# EAGLE design main_V2 (EAGLE 8.5.1)

## Sheet 1 of 7: ESP-12E Main
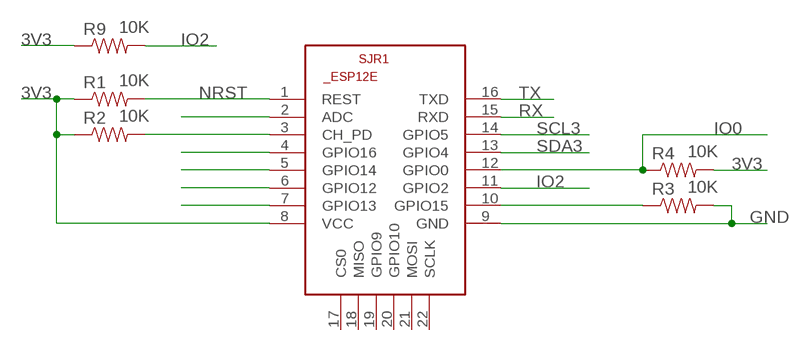
[diagram p0: schematic, sheet 1]

### Parts
R1  10K  RESISTOR1206  [1206]
R2  10K  RESISTOR1206  [1206]
R3  10K  RESISTOR1206  [1206]
R4  10K  RESISTOR1206  [1206]
R9  10K  RESISTOR1206  [1206]
SJR1  ESP8266-12EESP12E  [ESP8266-ESP12E]

### Nets
3V3: R1.1 R2.1 R4.2 R9.1 SJR1.8(VCC) ; also sheet 4,5
GND: R3.2 SJR1.9(GND) ; also sheet 2,3,4,6,7
IO0: R4.1 SJR1.12(GPIO0) ; also sheet 2
IO2: R9.2 SJR1.11(GPIO2)
N$2: R2.2 SJR1.3(CH_PD)
N$4: R3.1 SJR1.10(GPIO15)
N$8: SJR1.2(ADC)
N$9: SJR1.4(GPIO16)
N$10: SJR1.5(GPIO14)
N$11: SJR1.6(GPIO12)
N$12: SJR1.7(GPIO13)
NRST: R1.2 SJR1.1(REST) ; also sheet 2
RX: SJR1.15(RXD) ; also sheet 2
SCL3: SJR1.14(GPIO5) ; also sheet 5
SDA3: SJR1.13(GPIO4) ; also sheet 5
TX: SJR1.16(TXD) ; also sheet 2
Unconnected: SJR1.17(CS0) SJR1.18(MISO) SJR1.19(GPIO9) SJR1.20(GPIO10) SJR1.21(MOSI) SJR1.22(SCLK)

## Sheet 2 of 7: USB Interface
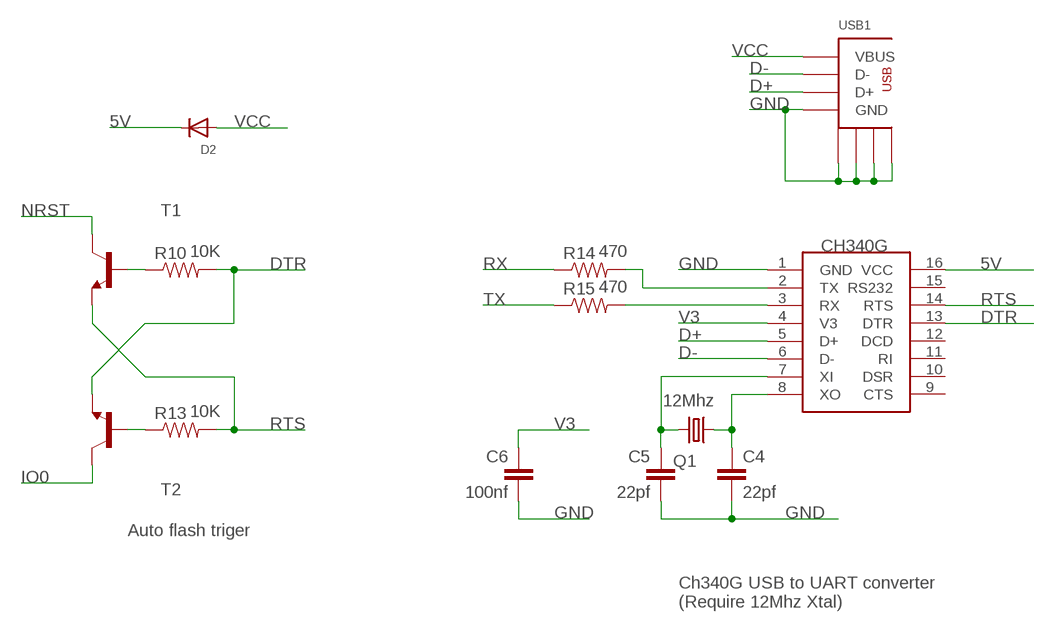
[diagram p1: schematic, sheet 2]

### Parts
C4  22pf  C-EUC1206K  [C1206K]
C5  22pf  C-EUC1206K  [C1206K]
C6  100nf  C-EUC1206K  [C1206K]
D2  DIODESMA  [SMADIODE]
Q1  12Mhz  CSM-7X-DU  [CSM-7X-DU]
R10  10K  RESISTOR1206  [1206]
R13  10K  RESISTOR1206  [1206]
R14  470  RESISTOR1206  [1206]
R15  470  RESISTOR1206  [1206]
T1  MMBT5551LT1-NPN-SOT23-BEC  [SOT23-BEC]
T2  MMBT5551LT1-NPN-SOT23-BEC  [SOT23-BEC]
U$1  CH340G  [SOIC16]
USB1  USB3MINI  [USB-MB-S]

### Nets
5V: D2.C U$1.16(VCC) ; also sheet 4,5,6
D+: U$1.5(D+) USB1.D+
D-: U$1.6(D-) USB1.D-
DTR: R10.2 T2.E U$1.13(DTR)
GND: C4.2 C5.2 C6.2 U$1.1(GND) USB1.GND USB1.P$1(GND) USB1.P$2(GND) USB1.P$3(GND) USB1.P$4(GND) ; also sheet 1,3,4,6,7
IO0: T2.C ; also sheet 1
N$13: C4.1 Q1.1 U$1.8(XO)
N$14: C5.1 Q1.2 U$1.7(XI)
N$15: R10.1 T1.B
N$18: R13.1 T2.B
N$19: R15.2 U$1.3(RX)
N$20: R14.2 U$1.2(TX)
NRST: T1.C ; also sheet 1
RTS: R13.2 T1.E U$1.14(RTS)
RX: R14.1 ; also sheet 1
TX: R15.1 ; also sheet 1
V3: C6.1 U$1.4(V3)
VCC: D2.A USB1.VBUS
Unconnected: U$1.9(CTS) U$1.10(DSR) U$1.11(RI) U$1.12(DCD) U$1.15(RS232)

### Notes on the sheet
- Auto flash triger
- Ch340G USB to UART converter 
  (Require 12Mhz Xtal)

## Sheet 3 of 7: Lio-Ion Charging
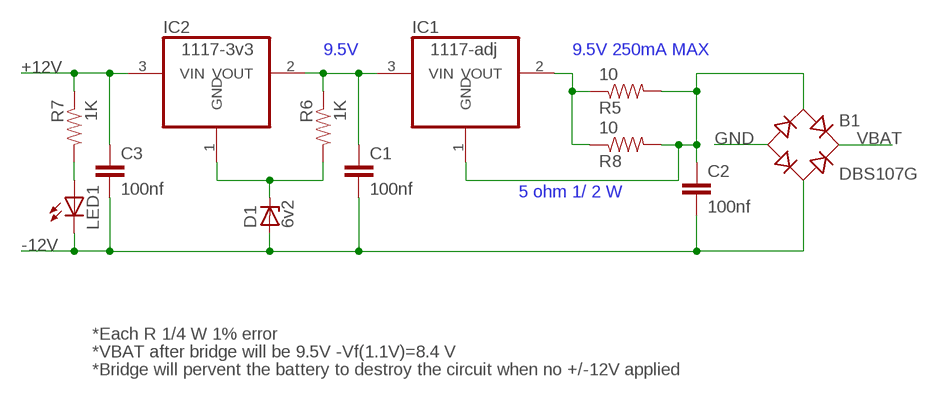
[diagram p2: schematic, sheet 3]

### Parts
B1  DBS107G  [DBS]
C1  100nf  C-EUC1206K  [C1206K]
C2  100nf  C-EUC1206K  [C1206K]
C3  100nf  C-EUC1206K  [C1206K]
D1  6v2  ZENER-DIODESOT23  [SOT23]
IC1  1117-adj  REG1117  [SOT223]
IC2  1117-3v3  REG1117  [SOT223]
LED1  LEDSMT1206  [1206]
R5  10  RESISTOR1206  [1206]
R6  1K  RESISTOR1206  [1206]
R7  1K  RESISTOR1206  [1206]
R8  10  RESISTOR1206  [1206]

### Nets
+12V: C3.1 IC2.3(VIN) R7.1
-12V: B1.AC2 C1.2 C2.2 C3.2 D1.1(A) LED1.C
GND: B1.- ; also sheet 1,2,4,6,7
N$3: D1.3(C) IC2.1(GND) R6.2
N$5: B1.AC1 C2.1 IC1.1(GND) R5.2 R8.2
N$6: IC1.2(VOUT) R5.1 R8.1
N$7: C1.1 IC1.3(VIN) IC2.2(VOUT) R6.1
N$17: LED1.A R7.2
VBAT: B1.+ ; also sheet 4

### Notes on the sheet
- 9.5V | 9.5V 250mA MAX
- 5 ohm 1/ 2 W
- *Each R 1/4 W 1% error
- *VBAT after bridge will be 9.5V -Vf(1.1V)=8.4 V
- *Bridge will pervent the battery to destroy the circuit when no +/-12V applied

## Sheet 4 of 7: power manegment
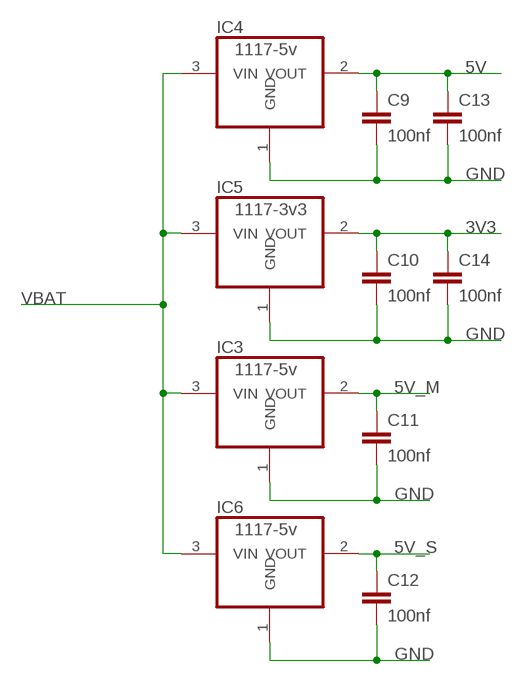
[diagram p3: schematic, sheet 4]

### Parts
C9  100nf  C-EUC1206K  [C1206K]
C10  100nf  C-EUC1206K  [C1206K]
C11  100nf  C-EUC1206K  [C1206K]
C12  100nf  C-EUC1206K  [C1206K]
C13  100nf  C-EUC1206K  [C1206K]
C14  100nf  C-EUC1206K  [C1206K]
IC3  1117-5v  REG1117  [SOT223]
IC4  1117-5v  REG1117  [SOT223]
IC5  1117-3v3  REG1117  [SOT223]
IC6  1117-5v  REG1117  [SOT223]

### Nets
3V3: C10.1 C14.1 IC5.2(VOUT) ; also sheet 1,5
5V: C9.1 C13.1 IC4.2(VOUT) ; also sheet 2,5,6
5V_M: C11.1 IC3.2(VOUT) ; also sheet 7
5V_S: C12.1 IC6.2(VOUT)
GND: C9.2 C10.2 C11.2 C12.2 C13.2 C14.2 IC3.1(GND) IC4.1(GND) IC5.1(GND) IC6.1(GND) ; also sheet 1,2,3,6,7
VBAT: IC3.3(VIN) IC4.3(VIN) IC5.3(VIN) IC6.3(VIN) ; also sheet 3

## Sheet 5 of 7: I2C Logic Level Converter
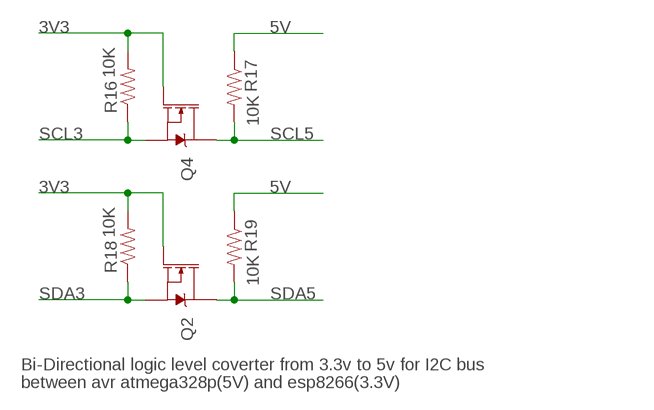
[diagram p4: schematic, sheet 5]

### Parts
Q2  MOSFET-NCH-BSS138  [SOT23-3]
Q4  MOSFET-NCH-BSS138  [SOT23-3]
R16  10K  RESISTOR1206  [1206]
R17  10K  RESISTOR1206  [1206]
R18  10K  RESISTOR1206  [1206]
R19  10K  RESISTOR1206  [1206]

### Nets
3V3: Q2.1(G) Q4.1(G) R16.2 R18.2 ; also sheet 1,4
5V: R17.1 R19.1 ; also sheet 2,4,6
SCL3: Q4.2(S) R16.1 ; also sheet 1
SCL5: Q4.3(D) R17.2 ; also sheet 6
SDA3: Q2.2(S) R18.1 ; also sheet 1
SDA5: Q2.3(D) R19.2 ; also sheet 6

### Notes on the sheet
- Bi-Directional logic level coverter from 3.3v to 5v for I2C bus
- between avr atmega328p(5V) and esp8266(3.3V)

## Sheet 6 of 7: Atmeg328p TQFP
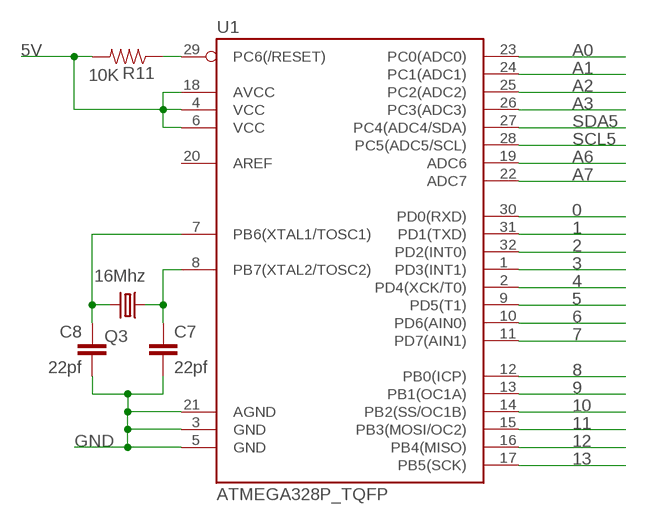
[diagram p5: schematic, sheet 6]

### Parts
C7  22pf  C-EUC1206K  [C1206K]
C8  22pf  C-EUC1206K  [C1206K]
Q3  16Mhz  CSM-7X-DU  [CSM-7X-DU]
R11  10K  RESISTOR1206  [1206]
U1  ATMEGA328P_TQFP  [TQFP32-08]

### Nets
0: U1.30(PD0(RXD))
1: U1.31(PD1(TXD))
2: U1.32(PD2(INT0))
3: U1.1(PD3(INT1))
4: U1.2(PD4(XCK/T0))
5: U1.9(PD5(T1))
5V: R11.2 U1.4(VCC) U1.6(VCC) U1.18(AVCC) ; also sheet 2,4,5
6: U1.10(PD6(AIN0))
7: U1.11(PD7(AIN1))
8: U1.12(PB0(ICP))
9: U1.13(PB1(OC1A))
10: U1.14(PB2(SS/OC1B))
11: U1.15(PB3(MOSI/OC2))
12: U1.16(PB4(MISO))
13: U1.17(PB5(SCK))
A0: U1.23(PC0(ADC0))
A1: U1.24(PC1(ADC1))
A2: U1.25(PC2(ADC2))
A3: U1.26(PC3(ADC3))
A6: U1.19(ADC6)
A7: U1.22(ADC7)
GND: C7.2 C8.2 U1.3(GND) U1.5(GND) U1.21(AGND) ; also sheet 1,2,3,4,7
N$1: C7.1 Q3.1 U1.8(PB7(XTAL2/TOSC2))
N$16: C8.1 Q3.2 U1.7(PB6(XTAL1/TOSC1))
N$21: R11.1 U1.29(PC6(/RESET))
SCL5: U1.28(PC5(ADC5/SCL)) ; also sheet 5
SDA5: U1.27(PC4(ADC4/SDA)) ; also sheet 5
Unconnected: U1.20(AREF)

## Sheet 7 of 7: DC H-Bridge
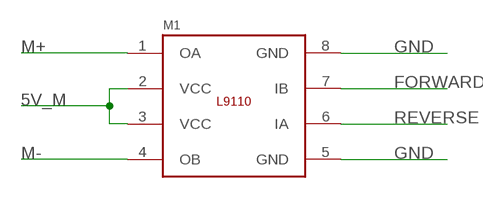
[diagram p6: schematic, sheet 7]

### Parts
M1  L9110  [SO8P]

### Nets
5V_M: M1.2(VCC) M1.3(VCC) ; also sheet 4
FORWARD: M1.7(IB)
GND: M1.5(GND) M1.8(GND) ; also sheet 1,2,3,4,6
M+: M1.1(OA)
M-: M1.4(OB)
REVERSE: M1.6(IA)

## Library data of the parts
B1 = rectifier:DB?*G: Single Phase 1.0 AMP Glass Passivated Bridge Rectifier Taiwan Semiconductor Co.,Ltd. - TSC Source: http://www.taiwansemi.com/TSCbig5/ezcatfiles/cust/img/img/db101g.pdf http://www.ts.com.tw/db/pictures/modules/PDT/PDT060207001/DBLS201G.pdf
C1-C14 = rcl:C-EU: CAPACITOR, European symbol; SPICEPREFIX: C
D1 = diode:ZENER-DIODE: Z-Diode
D2 = adafruit:DIODE: Diode SMADIODE - SMA Surface Mount Package 20V 1A Schottky Diode Digikey: 641-1014-6-ND DO-1N4148 - Through Hole Small Current Diode SOD-123 20V 1 A (.5mV Vf) Schottky Diode - Digikey: MBRX120TPMSCT-ND SOD-323 10V 570mA (.38mV Vf, 3ns) Schottky Diode - Digikey: ZLLS410CT-ND SOD-523 30V 30mA Schottky Diode (RB751S-40TE61) - Digikey: RB751S-40TE61CT-ND SOT23-R/W - SOT23 Package (R = Solder Paste/Reflow Ovens, W = Hand-Soldering) BAT54Film 40V 300mA - Digikey: 497-7162-1-ND
IC1-IC6 = burr-brown:REG1117: 800mA and 1A Low Dropout (LDO) Positive Regulator 1.8V, 2.5V, 2.85V, 3.3V, 5V, and Adj; MPN: REG1117; OC_FARNELL: 1097566; OC_NEWARK: 14P6981
LED1 = adafruit:LED: LED OSRAM: - CHIPLED LG R971, LG N971, LY N971, LG Q971, LY Q971, LO R971, LY R971 LH N974, LH R974 LS Q976, LO Q976, LY Q976 LO Q996 - Hyper CHIPLED LW Q18S LB Q993, LB Q99A, LB R99A - SideLED LS A670, LO A670, LY A670, LG A670, LP A670 LB A673, LV A673, LT A673, LW A673 LH A674 LY A675 LS A676, LA A676, LO A676, LY A676, LW A676 LS A679, LY A679, LG A679 - Hyper Micro SIDELED® LS Y876, LA Y876, LO Y876, LY Y876 LT Y87S - SmartLED LW L88C, LW L88S LB L89C, LB L89S, LG L890 LS L89K, LO L89K, LY L89K LS L896, LA L896, LO L896, LY L896 - TOPLED LS T670, LO T670, LY T670, LG T670, LP T670 LSG T670, LSP T670, LSY T670, LOP T670, LYG T670 LG T671, LOG T671, LSG T671 LB T673, LV T673, LT T673, LW T673 LH T674 LS T676, LA T676, LO T676, LY T676, LB T676, LH T676, LSB T676, LW T676 LB T67C, LV T67C, LT T67C, LS T67K, LO T67K, LY T67K, LW E67C LS E67B, LA E67B, LO E67B, LY E67B, LB E67C, LV E67C, LT E67C LW T67C LS T679, LY T679, LG T679 LS T770, LO T770, LY T770, LG T770, LP T770 LB T773, LV T773, LT T773, LW T773 LH T774 LS E675, LA E675, LY E675, LS T675 LS T776, LA T776, LO T776, LY T776, LB T776 LHGB T686 LT T68C, LB T68C - Hyper Mini TOPLED® LB M676 - Mini TOPLED Santana® LG M470 LS M47K, LO M47K, LY M47K Source: http://www.osram.convergy.de/
M1 = FaBo-Motor:L9110
Q1 Q3 = crystal:CSM-7X-DU: SMD CRYSTAL Source: www.ecsxtal.com .. Crystal 3.6864MHz CSM_7X_DU.PDF; OC_FARNELL: unknown; OC_NEWARK: unknown
Q2 Q4 = SparkFun-DiscreteSemi:MOSFET-NCH: N-channel MOSFETs Voltage controlled devices that allow control of high current outputs. SparkFun Products: SparkFun OpenScale <https://www.sparkfun.com/products/13261> SparkFun Digital Sandbox <https://www.sparkfun.com/products/12651> SparkFun Monster Moto Shield <https://www.sparkfun.com/products/10182> SparkFun MOSFET Power Controller <https://www.sparkfun.com/products/11214>; PROD_ID: TRANS-00830; VALUE: 220mA/50V/3.5Ω
R1-R11 R13-R19 = SparkFun:RESISTOR: Resistor Basic schematic elements and footprints for 0603, 1206, and PTH 1/10th watt (small) resistors.
SJR1 = esp12e:ESP8266-12E: ESP8266-12E Library for Eagle CAD The author not responsible for any damages or errors!. Created by Suhail jr.lt;/author>
T1 T2 = DC_LOAD_AU:*-NPN-: NPN Transistror BF959 corrected 2008.03.06
U1 = SparkFun-IC-Microcontroller:ATMEGA328P_TQFP: Popular 328P in QFP Storefront component: ATmega328 - TQFP <https://www.sparkfun.com/products/13448> (COM-13448) Datasheet <http://www.sparkfun.com/datasheets/Components/SMD/ATMega328.pdf> SparkFun Products SparkFun RedBoard - Programmed with Arduino <https://www.sparkfun.com/products/12757> (DEV-12757) Arduino Pro Mini 328 - 5V/16MHz <https://www.sparkfun.com/products/11113> (DEV-11113) Arduino Pro Mini 328 - 3.3V/8MHz <https://www.sparkfun.com/products/11114> (DEV-11114) SparkFun OpenLog <https://www.sparkfun.com/products/13712> (DEV-13712) SparkFun MicroView - OLED Arduino Module <https://www.sparkfun.com/products/12923> (DEV-12923) SparkFun Digital Sandbox <https://www.sparkfun.com/products/12651> (DEV-12651) SparkFun PicoBoard <https://www.sparkfun.com/products/11888> (WIG-11888) Arduino Fio <https://www.sparkfun.com/products/10116> (DEV-10116) LilyPad Arduino 328 Main Board <https://www.sparkfun.com/products/13342> (DEV-13342) SparkFun RedStick <https://www.sparkfun.com/products/13741> (DEV-13741) LilyPad MP3 <https://www.sparkfun.com/products/11013> (DEV-11013) LilyPad Arduino SimpleSnap <https://www.sparkfun.com/products/10941> (DEV-10941) SparkFun Stepoko <https://www.sparkfun.com/products/13899> (ROB-13899) SparkFun Geiger Counter <https://www.sparkfun.com/products/11345> (SEN-11345) SparkFun EL Sequencer <https://www.sparkfun.com/products/12781> (COM-12781) Arduino Pro 328 - 5V/16MHz <https://www.sparkfun.com/products/10915> (DEV-10915) CryptoCape <https://www.sparkfun.com/products/12773> (DEV-12773) SparkFun IR Thermometer Evaluation Board - MLX90614 <https://www.sparkfun.com/products/10740> (SEN-10740) SparkFun RedBot Mainboard <https://www.sparkfun.com/products/12097> (ROB-12097) Arduino Pro 328 - 3.3V/8MHz <https://www.sparkfun.com/products/10914> (DEV-10914) SparkFun Block for Intel® Edison - Arduino <https://www.sparkfun.com/products/13036> (DEV-13036) SparkFun Simon Says - Surface Mount Soldering Kit <https://www.sparkfun.com/products/10935> (KIT-10935) SparkFun 7-Segment Serial Display - Red <https://www.sparkfun.com/products/11441> (COM-11441) SparkFun 7-Segment Serial Display - White <https://www.sparkfun.com/products/11629> (COM-11629) SparkFun 7-Segment Serial Display - Yellow <https://www.sparkfun.com/products/11443> (COM-11443) SparkFun 7-Segment Serial Display - Kelly Green <https://www.sparkfun.com/products/11440> (COM-11440) SparkFun 7-Segment Serial Display - Blue <https://www.sparkfun.com/products/11442> (COM-11442) SparkFun OpenSegment Serial Display - 20mm (Blue) <https://www.sparkfun.com/products/11647> (COM-11647) SparkFun OpenSegment Serial Display - 20mm (Green) <https://www.sparkfun.com/products/11646> (COM-11646) SparkFun OpenSegment Serial Display - 20mm (White) <https://www.sparkfun.com/products/11648> (COM-11648) SparkFun OpenSegment Serial Display - 20mm (Red) <https://www.sparkfun.com/products/11644> (COM-11644) SparkFun OpenSegment Serial Display - 20mm (Yellow) <https://www.sparkfun.com/products/11645> (COM-11645) SparkFun OpenSegment Shield <https://www.sparkfun.com/products/13190> (DEV-13190); PROD_ID: IC-09069
U$1 = ch340g:CH340G
USB1 = dodolcd:USB3: connettore USB verticale

## Board
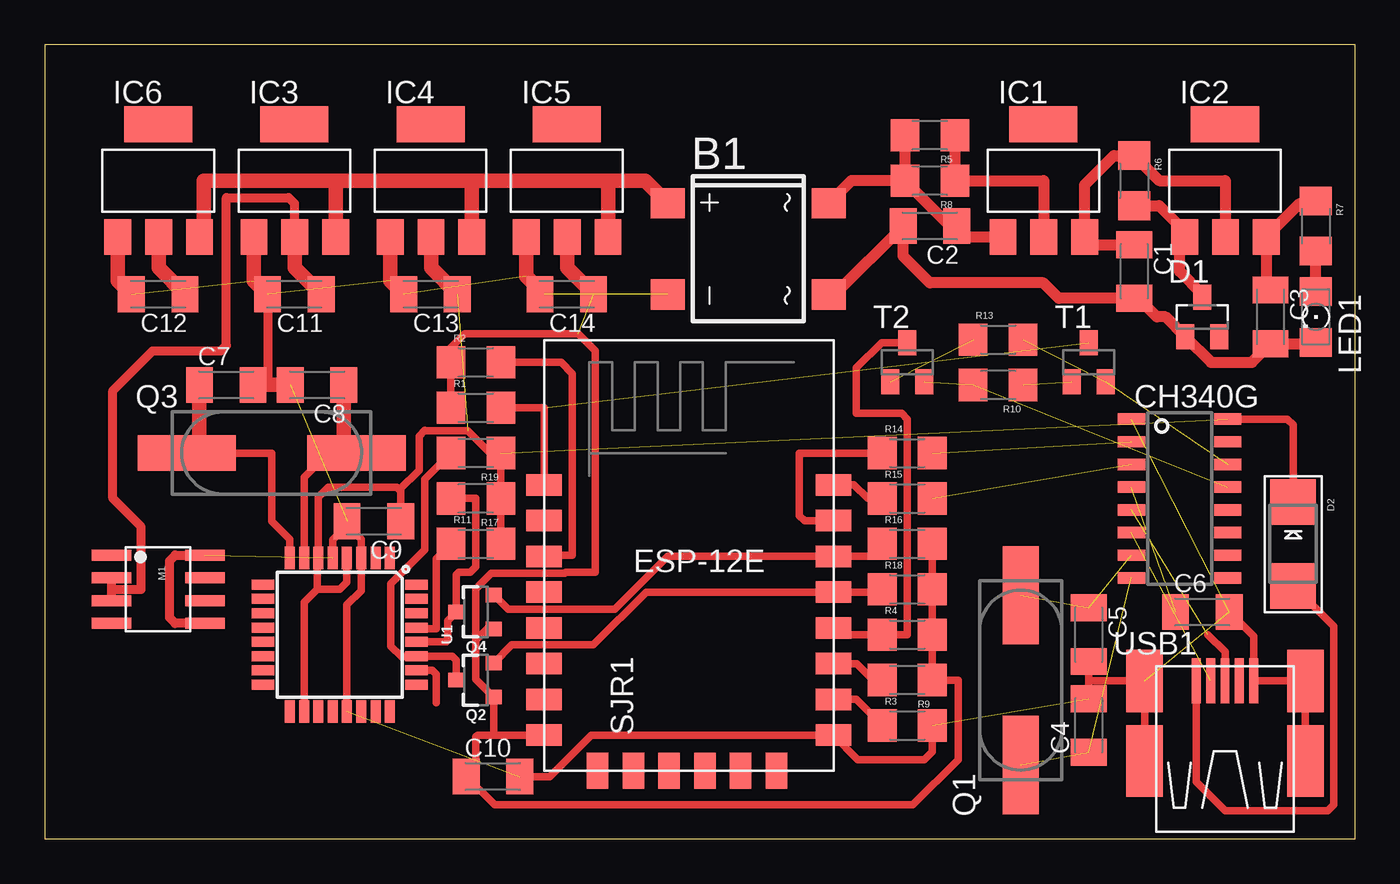
[diagram p7: board, top side]

Size 73.33 x 44.44 mm. Coordinates in mm from the lower left corner, seen from the top.
Outline: 0,0 73.33,0 73.33,44.44 0,44.44 0,0
Copper layers (1*16): Top 0.035mm / dielectric 1.5mm / Bottom 0.035mm
Design rules "default": minimum track width 6mil, minimum drill 0.35mm, track to track 6mil, track to pad 6mil, pad to pad 6mil, via to via 6mil, smd to smd 6mil, copper to edge 40mil, drill to drill 6mil, minimum pad ring 10mil, minimum via ring 8mil, stop-mask expansion 4mil, vias tented up to drill 0mil, thermal gap 10mil

### Footprints (pad centres in the part's own frame; a part is rotated, then mirrored left to right if it is on the bottom)
DBS = smd 1.7 x 1.9: + -2.55,-4.5; - 2.55,-4.5; AC1 -2.55,4.5; AC2 2.55,4.5
C1206K = smd 1.5 x 2: 1 -1.5,0; 2 1.5,0
SOT23 = smd 1 x 1.4: 1 -0.95,-1.1; 2 0.95,-1.1; 3 0,1.1
SMADIODE = smd 2.54 x 2.54: A 2.349,0; C -2.349,0
SOT223 = smd 1.499 x 2.007: 1 -2.261,-3.15; 2 0.025,-3.15; 3 2.311,-3.15 | smd 3.81 x 2.007: 4 0,3.15
1206 = smd 1.6 x 1.803: A -1.422,0; C 1.422,0
SO8P = smd 0.61 x 2.21: 1 -1.905,-2.616; 2 -0.635,-2.616; 3 0.635,-2.616; 4 1.905,-2.616; 5 1.905,2.616; 6 0.635,2.616; 7 -0.635,2.616; 8 -1.905,2.616
CSM-7X-DU = smd 5.5 x 2: 1 -4.75,0; 2 4.75,0
SOT23-3 = smd 0.8 x 0.9: 1 -0.95,-1; 2 0.95,-1; 3 0,1.1
1206' = smd 1.6 x 1.8: 1 -1.4,0; 2 1.4,0
ESP8266-ESP12E = smd 2 x 1.2: 1 -7.62,5.84; 2 -7.62,3.84; 3 -7.62,1.84; 4 -7.62,-0.16; 5 -7.62,-2.16; 6 -7.62,-4.16; 7 -7.62,-6.16; 8 -7.62,-8.16; 9 8.58,-8.16; 10 8.58,-6.16; 11 8.58,-4.16; 12 8.58,-2.16; 13 8.58,-0.16; 14 8.58,1.84; 15 8.58,3.84; 16 8.58,5.84 | smd 1.2 x 2: 17 -4.62,-10.16; 18 -2.62,-10.16; 19 -0.62,-10.16; 20 1.38,-10.16; 21 3.38,-10.16; 22 5.38,-10.16
SOT23-BEC = smd 1 x 1.4: B -0.95,-1.1; C 0,1.1; E 0.95,-1.1
TQFP32-08 = smd 1.27 x 0.559: 1 -4.293,2.8; 2 -4.293,2; 3 -4.293,1.2; 4 -4.293,0.4; 5 -4.293,-0.4; 6 -4.293,-1.2; 7 -4.293,-2; 8 -4.293,-2.8; 17 4.293,-2.8; 18 4.293,-2; 19 4.293,-1.2; 20 4.293,-0.4; 21 4.293,0.4; 22 4.293,1.2; 23 4.293,2; 24 4.293,2.8 | smd 0.559 x 1.27: 9 -2.8,-4.293; 10 -2,-4.293; 11 -1.2,-4.293; 12 -0.4,-4.293; 13 0.4,-4.293; 14 1.2,-4.293; 15 2,-4.293; 16 2.8,-4.293; 25 2.8,4.293; 26 2,4.293; 27 1.2,4.293; 28 0.4,4.293; 29 -0.4,4.293; 30 -1.2,4.293; 31 -2,4.293; 32 -2.8,4.293
SOIC16 = smd 0.635 x 1.524: 1 -4.445,-2.695; 2 -3.175,-2.695; 3 -1.905,-2.695; 4 -0.635,-2.695; 5 0.635,-2.695; 6 1.905,-2.695; 7 3.175,-2.695; 8 4.445,-2.695; 9 4.445,2.695; 10 3.175,2.695; 11 1.905,2.695; 12 0.635,2.695; 13 -0.635,2.695; 14 -1.905,2.695; 15 -3.175,2.695; 16 -4.445,2.695
USB-MB-S = smd 2.5 x 0.5: D+ 2.5,0; D- 2.5,0.8; GND 2.5,-1.6; ID 2.5,-0.8; VBUS 2.5,1.6 | smd 4 x 2.05: P$1 -2,4.5; P$2 -2,-4.5 | smd 3.5 x 2.05: P$3 2.5,4.5; P$4 2.5,-4.5

### Placement (x,y rotation side)
B1  39.37,33.02 270 top
C1  60.96,31.75 270 top
C2  49.53,34.29 180 top
C3  68.58,29.21 270 top
C4  58.42,6.35 90 top
C5  58.42,11.43 270 top
C6  64.77,12.7 0 top
C7  10.16,25.4 0 top
C8  15.24,25.4 180 top
C9  18.42,17.78 180 top
C10  25.08,3.49 0 top
C11  13.97,30.48 180 top
C12  6.35,30.48 180 top
C13  21.59,30.48 180 top
C14  29.21,30.48 180 top
D1  64.77,29.21 0 top
D2  69.85,16.51 270 top
IC1  55.88,36.83 0 top
IC2  66.04,36.83 0 top
IC3  13.97,36.83 0 top
IC4  21.59,36.83 0 top
IC5  29.21,36.83 0 top
IC6  6.35,36.83 0 top
LED1  71.12,29.21 270 top
M1  6.35,13.97 270 top
Q1  54.61,8.89 90 top
Q2  24.13,8.89 90 top
Q3  12.7,21.59 0 top
Q4  24.13,12.7 90 top
R1  10K  [1206']  24.13,24.13 0 top
R2  10K  [1206']  24.13,26.67 0 top
R3  10K  [1206']  48.26,6.35 0 top
R4  10K  [1206']  48.26,11.43 0 top
R5  10  [1206']  49.53,39.37 180 top
R6  1K  [1206']  60.96,36.83 270 top
R7  1K  [1206']  71.12,34.29 270 top
R8  10  [1206']  49.53,36.83 180 top
R9  10K  [1206']  48.26,8.89 180 top
R10  10K  [1206']  53.34,25.4 180 top
R11  10K  [1206']  24.13,16.51 0 top
R13  10K  [1206']  53.34,27.94 0 top
R14  470  [1206']  48.26,21.59 0 top
R15  470  [1206']  48.26,19.05 0 top
R16  10K  [1206']  48.26,16.51 0 top
R17  10K  [1206']  24.13,19.05 180 top
R18  10K  [1206']  48.26,13.97 0 top
R19  10K  [1206']  24.13,21.59 180 top
SJR1  35.56,13.97 0 top
T1  58.42,26.67 0 top
T2  48.26,26.67 0 top
U1  16.51,11.43 270 top
U$1  63.5,19.05 270 top
USB1  66.04,6.35 90 top

### Tracks (layer width: path | path; a pad name or v marks a point on that pad's centre or on a via)
3V3  (1 unrouted)
  Top 0.406: 24.13,11.11 24.13,8.94 Q2.1 25.13,5.86 25.08,5.81 | Q4.1 24.77,11.75 24.13,11.11 | R1.1 R2.1 22.73,27.49 23.5,28.26 29.85,28.26 30.8,27.3 30.8,14.92 29.15,14.92 29.09,14.85 24.98,14.85 24.32,14.2 24.32,14.16 24.13,13.97 24.13,11.11 | R16.2 R18.2 | R18.2 49.66,13.52 49.85,13.33 49.85,13.78 R18.2 | R18.2 R4.2 R9.1 51.12,8.89 51.12,4.45 48.58,1.91 25.17,1.91 C10.1 24.13,4.04 24.13,5.71 24.22,5.81 25.08,5.81 | 25.08,5.81 SJR1.8
  Top 0.813: IC5.2 29.23,31.95 C14.1
5V  (2 unrouted)
  Top 0.406: 15.24,13.97 15.24,15.65 U1.6 15.31,19.12 15.87,19.68 19.68,19.68 19.84,19.53 | 15.24,13.97 16.51,13.97 16.91,14.37 U1.4 | 15.24,13.97 14.51,13.24 U1.18 | 19.84,19.53 19.92,19.45 C9.1 | R11.2 R17.1 R19.1 24.93,21.59 23.68,22.85 21.29,22.85 21.27,22.86 20.96,22.54 20.96,20.64 19.84,19.53 | D2.C 69.85,23.18 69.53,23.5 U$1.16
  Top 0.813: IC4.2 21.61,31.95 C13.1
5V_M
  Top 0.508: M1.2 3.73,13.97 | 3.73,13.97 M1.3 | 3.73,13.97 5.4,13.97 5.4,17.46 3.81,19.05 3.81,25.08 6.03,27.3 9.84,27.3 10.16,27.62 10.16,35.88 13.65,35.88 13.97,35.56 13.97,33.71 IC3.2
  Top 0.813: IC3.2 14,31.95 C11.1
5V_S
  Top 0.813: IC6.2 6.38,31.95 C12.1
+12V
  Top 0.61: R7.1 71.12,35.56 70.23,35.56 IC2.3 68.35,30.94 C3.1
-12V
  Top 0.61: LED1.C 71.04,27.71 C3.2 67.54,26.67 65.26,26.67 D1.1 62.72,29.21 62.23,29.21 60.96,30.48 C1.2 56.75,30.25 55.88,31.11 49.53,31.11 48.03,32.62 C2.2 44.21,30.47 B1.AC2
A3
  Top 0.406: U1.26 21.68,9.43 21.91,9.21 21.91,7.62
D+  (1 unrouted)
  Top 0.406: USB1.D+ 66.04,10.48 65.09,11.43
D-  (1 unrouted)
DTR  (2 unrouted)
GND  (10 unrouted)
  Top 0.406: U1.5 16.11,16.75 16.92,17.55 | 16.92,17.55 C9.2 | 16.92,17.55 17.71,16.75 U1.3 17.71,13.9 16.91,13.1 U1.21 | R3.2 49.66,4.89 49.21,4.45 45.51,4.45 SJR1.9 30.57,5.81 28.26,3.49 C10.2 | USB1.P$1 USB1.P$3 58.46,8.85 58.42,8.89 | C4.2 58.42,8.89 | 58.42,8.89 C5.2 | USB1.P$2 USB1.P$4 USB1.GND 67.64,11.33 C6.2
  Top 0.508: M1.5 7.3,12.06 6.98,12.38 6.98,15.56 7.3,15.88 M1.8 | C11.2 12.47,25.49 12.38,25.4
  Top 0.813: IC5.1 26.95,31.47 27.94,30.48 C14.2 | IC4.1 19.33,31.24 C13.2 | IC3.1 11.71,31.24 C11.2 | IC6.1 4.09,31.24 C12.2 | C8.2 12.38,25.4 C7.2
IO0
  Top 0.406: SJR1.12 44.52,11.43 R4.1 48.26,11.43 48.26,23.5 47.94,23.81 45.4,23.81 45.4,26.35 46.82,27.77 T2.C
IO2
  Top 0.406: R9.2 46.36,8.89 45.44,9.81 SJR1.11
N$1
  Top 0.406: U1.8 13.71,16.77 12.7,17.78 12.7,21.59 8.89,21.59
  Top 0.813: C7.1 8.66,21.82 8.89,21.59 Q3.1
N$2
  Top 0.406: R2.2 28.89,26.67 29.53,26.04 29.53,15.88 28,15.88 SJR1.3
N$3
  Top 0.61: R6.2 62.36,35.43 63.78,34.01 IC2.1 63.5,33.4 63.5,31.75 64.77,30.48 D1.3
N$4
  Top 0.406: R3.1 45.4,7.81 SJR1.10
N$5
  Top 0.61: R5.2 R8.2 | R8.2 50.67,34.29 C2.1 51.64,33.68 IC1.1 | R8.2 45.13,36.83 B1.AC1
N$6
  Top 0.61: R5.1 R8.1 55.88,36.83 55.91,36.8 IC1.2
N$7
  Top 0.61: C1.1 58.62,33.25 IC1.3 58.19,36.6 59.82,38.23 R6.1 62.36,36.83 66.04,36.83 66.06,36.8 IC2.2
N$13  (2 unrouted)
N$14  (2 unrouted)
N$15  (1 unrouted)
N$16
  Top 0.406: U1.7 14.51,20.22 16.58,22.3 16.74,22.3
  Top 0.813: C8.1 16.74,22.3 Q3.2
N$17
  Top 0.61: LED1.A R7.2
N$18  (1 unrouted)
N$19  (1 unrouted)
N$20  (1 unrouted)
N$21
  Top 0.406: R11.1 21.91,15.69 21.91,11.75 20.89,11.75 U1.29
NRST  (1 unrouted)
  Top 0.406: R1.2 27.94,24.13 SJR1.1
RTS  (2 unrouted)
RX
  Top 0.406: SJR1.15 42.52,17.81 42.23,18.1 42.23,21.59 R14.1
SCL3
  Top 0.406: Q4.2 25.93,12.85 31.9,12.85 34.86,15.81 SJR1.14 46.16,15.81 R16.1
SCL5
  Top 0.406: R17.2 24.13,19.05 24.13,15.24 23.81,14.92 23.18,14.92 23.03,14.78 Q4.3 22.54,12.21 22.54,11.11 22.46,11.03 U1.28
SDA3
  Top 0.406: Q2.2 26.14,10.85 30.69,10.85 33.65,13.81 SJR1.13 46.7,13.81 R18.1
SDA5
  Top 0.406: R19.2 21.27,20.13 21.27,16.19 19.37,14.29 19.37,10.79 20,10.16 20.07,10.23 U1.27 22.79,10.23 23.03,9.99 Q2.3
TX
  Top 0.406: SJR1.16 45.28,19.81 46.04,19.05 R15.1
V3  (1 unrouted)
VBAT
  Top 0.813: B1.+ 33.61,36.83 31.75,36.83 | IC6.3 8.89,33.91 8.89,36.83 16.51,36.83 | 31.75,36.83 24.13,36.83 | 24.13,36.83 16.51,36.83 | IC3.3 16.28,36.6 16.51,36.83 | IC4.3 23.9,36.6 24.13,36.83 | IC5.3 31.52,36.6 31.75,36.83
VCC
  Top 0.406: D2.A 72.11,11.9 72.11,1.91 71.79,1.59 66.04,1.59 64.44,3.19 USB1.VBUS